# EAGLE schematic PIC16F876A (EAGLE 9.1.3)
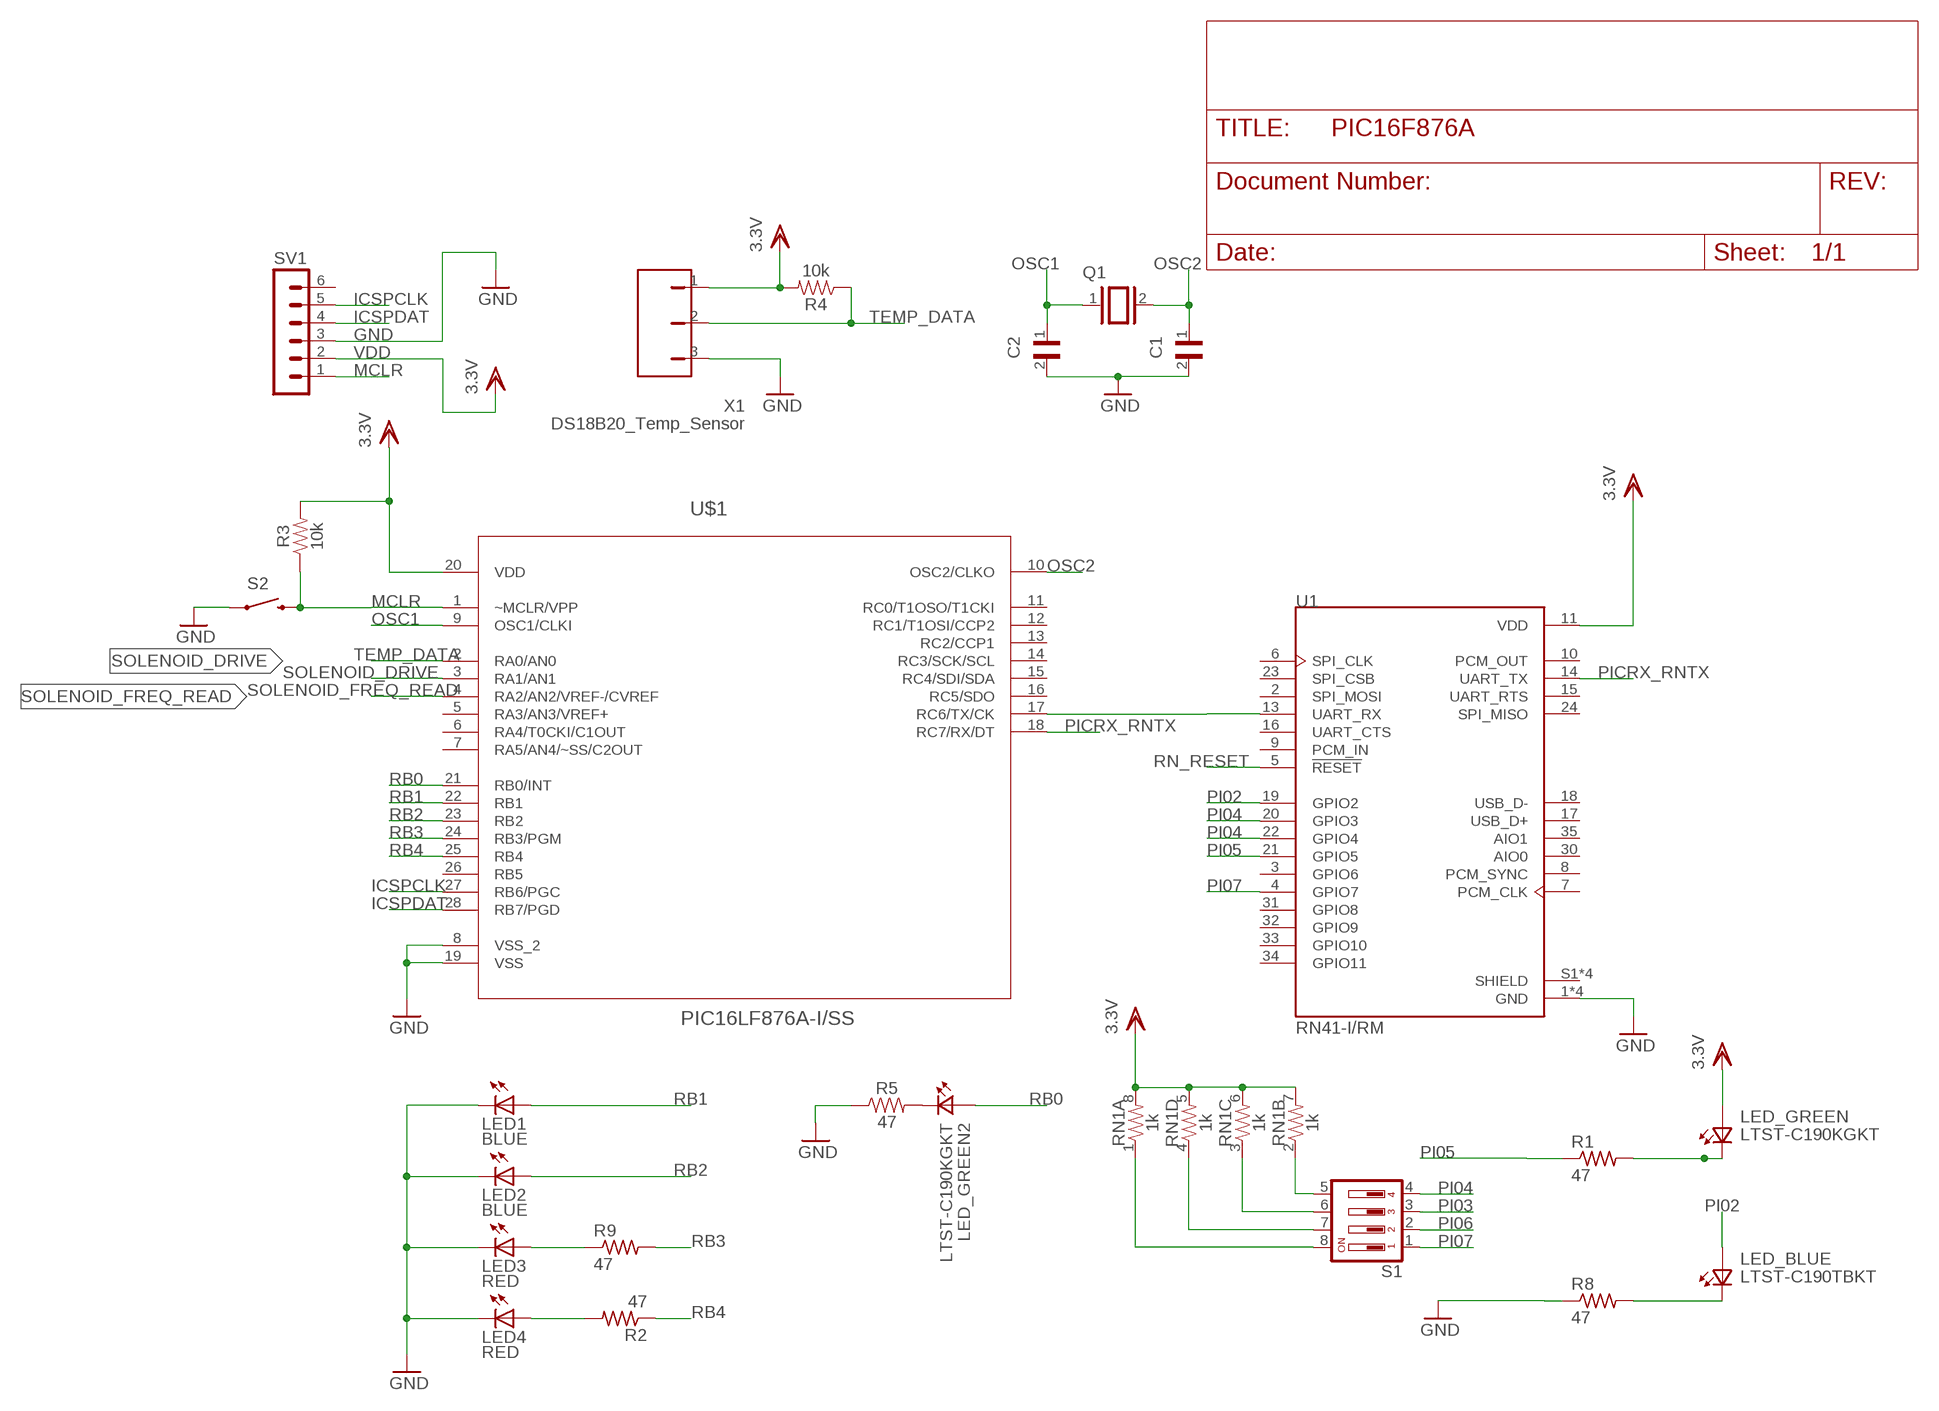
[diagram p0: schematic, sheet 1]

## Parts
C1  08052U220JAT2A  [CAPC2012X140N]
C2  08052U220JAT2A  [CAPC2012X140N]
LED1  BLUE  LED_E  [LED_1206]
LED2  BLUE  LED_E  [LED_1206]
LED3  RED  LED_E  [LED_1206]
LED4  RED  LED_E  [LED_1206]
LED_BLUE  LTST-C190TBKT  [0603]
LED_GREEN  LTST-C190KGKT  [0603]
LED_GREEN2  LTST-C190KGKT  [0603]
Q1  XTAL/S  [QS]
R1  47  R-US_0204/7  [0204/7]
R2  47  R-US_0204/7  [0204/7]
R3  10k  10KOHM-0603-1/10W-1%  [0603]
R4  10k  10KOHM-0603-1/10W-1%  [0603]
R5  47  220OHM-0603-1/10W-1%  [0603]
R8  47  R-US_0204/7  [0204/7]
R9  47  R-US_0204/7  [0204/7]
RN1  1k  1KOHM-ARRAY(4)-0805_ARV-1/10W-5%  [0805-ARV]
S1  DIP04YL  [DIP04YL]
S2  SWITCH-MOMENTARY-SPSTSMD-3  [TACTILE_SWITCH_SMD-3]
SV1  MA06-1  [MA06-1]
U1  RN41-I/RM  [XCVR_RN42-I/RM]
U$1  PIC16LF876A-I/SS  [SOP254P785X200-28N]
X1  DS18B20_Temp_Sensor  S3B-XH-A(LF)(SN)  [S3B-XH-A(LF)(SN)]

## Nets
GND: C1.2 C2.2 LED1.C LED2.C LED3.C LED4.C R5.1 R8.1 S2.1 SV1.3 U1.1(GND) U1.12(GND) U1.28(GND) U1.29(GND) U$1.8(VSS_2) U$1.19(VSS) X1.3
ICSPCLK: SV1.5 U$1.27(RB6/PGC)
ICSPDAT: SV1.4 U$1.28(RB7/PGD)
MCLR: SV1.1 U$1.1(~MCLR/VPP)
N$1: R9.2
N$2: LED_GREEN.1(K2) R1.2
N$3: U1.13(UART_RX) U$1.17(RC6/TX/CK)
N$4: R3.1 S2.4
N$5: U$1.20(VDD)
N$6: LED_GREEN2.1(K2) R5.2
N$7: RN1.2 S1.5
N$8: RN1.3 S1.6
N$9: RN1.4 S1.7
N$10: RN1.1 S1.8
N$15: R2.1
N$17: LED_BLUE.1(K2) R8.2
OSC1: C2.1 Q1.1 U$1.9(OSC1/CLKI)
OSC2: C1.1 Q1.2 U$1.10(OSC2/CLKO)
PI02: LED_BLUE.2(A2) U1.19(GPIO2)
PI03: S1.3
PI04: S1.4 U1.20(GPIO3) U1.22(GPIO4)
PI05: R1.1 U1.21(GPIO5)
PI06: S1.2
PI07: S1.1 U1.4(GPIO7)
PICRX_RNTX: U1.14(UART_TX) U$1.18(RC7/RX/DT)
RB0: LED_GREEN2.2(A2) U$1.21(RB0/INT)
RB1: LED1.A U$1.22(RB1)
RB2: LED2.A U$1.23(RB2)
RB3: LED3.A R9.1 U$1.24(RB3/PGM)
RB4: LED4.A R2.2 U$1.25(RB4)
RN_RESET: U1.5(!RESET)
SOLENOID_DRIVE: U$1.3(RA1/AN1)
SOLENOID_FREQ_READ: U$1.4(RA2/AN2/VREF-/CVREF)
TEMP_DATA: R4.1 U$1.2(RA0/AN0) X1.2
VDD: LED_GREEN.2(A2) R3.2 R4.2 RN1.5 RN1.6 RN1.7 RN1.8 SV1.2 U1.11(VDD) X1.1 ; supply symbol labelled 3.3V
Unconnected: SV1.6 U1.2(SPI_MOSI) U1.3(GPIO6) U1.6(SPI_CLK) U1.7(PCM_CLK) U1.8(PCM_SYNC) U1.9(PCM_IN) U1.10(PCM_OUT) U1.15(UART_RTS) U1.16(UART_CTS) U1.17(USB_D+) U1.18(USB_D-) U1.23(SPI_CSB) U1.24(SPI_MISO) U1.30(AIO0) U1.31(GPIO8) U1.32(GPIO9) U1.33(GPIO10) U1.34(GPIO11) U1.35(AIO1) U$1.5(RA3/AN3/VREF+) U$1.6(RA4/T0CKI/C1OUT) U$1.7(RA5/AN4/~SS/C2OUT) U$1.11(RC0/T1OSO/T1CKI) U$1.12(RC1/T1OSI/CCP2) U$1.13(RC2/CCP1) U$1.14(RC3/SCK/SCL) U$1.15(RC4/SDI/SDA) U$1.16(RC5/SDO) U$1.26(RB5)

## Power pins joined to a net without a drawn wire
SHIELD: U1.S1(SHIELD) U1.S2(SHIELD) U1.S3(SHIELD) U1.S4(SHIELD)

## Library data of the parts
C1 C2 = 08052U220JAT2A:08052U220JAT2A: Cap Ceramic 22pF 200V C0G 5% SMD 0805 125°C T/R; AVAILABILITY: Unavailable; DESCRIPTION: Cap Ceramic 22pF 200V C0G 5% SMD 0805 125°C T/R; MF: AVX; MP: 08052U220JAT2A; PACKAGE: 0805 AVX; PRICE: None
LED1-LED4 = eagle-ltspice:LED_E: LED Source: http://www.osram.convergy.de Source: www.luxeon.com Source: www.kingbright.com; SPICEMODEL: NONE; SPICEPREFIX: D; SPICETYPE: diode
LED_BLUE = LTST-C190TBKT:LTST-C190TBKT: http://octopart.com/ltst-c190tbkt-lite-on-550003; AVAILABILITY: Unavailable; DESCRIPTION: Blue 1.6 x 0.8 x 0.8 mm 130° Water Clear 112 mcd 3.8 V SMT LED; MF: Lite-On Inc.; MP: LTST-C190TBKT; PACKAGE: 0603 Lite-On; PRICE: None
LED_GREEN LED_GREEN2 = LTST-C190KGKT:LTST-C190KGKT: http://octopart.com/ltst-c190krkt-lite-on-549893; AVAILABILITY: Unavailable; DESCRIPTION: Green 1.6 x 0.8 x 0.8 mm 130° Water Clear 35 mcd 2 V LED SMT; MF: Lite-On Inc.; MP: LTST-C190KGKT; PACKAGE: 0603 Lite-On; PRICE: None
Q1 = special:XTAL/S: CRYSTAL
R1 R2 R8 R9 = rcl:R-US_: RESISTOR, American symbol; SPICEPREFIX: R
R3 R4 = SparkFun-Resistors:10KOHM: 10kΩ resistor A resistor is a passive two-terminal electrical component that implements electrical resistance as a circuit element. Resistors act to reduce current flow, and, at the same time, act to lower voltage levels within circuits. - Wikipedia; PROD_ID: RES-00824
R5 = SparkFun-Resistors:220OHM: 220Ω resistor A resistor is a passive two-terminal electrical component that implements electrical resistance as a circuit element. Resistors act to reduce current flow, and, at the same time, act to lower voltage levels within circuits. - Wikipedia; PROD_ID: RES-07861; VALUE: 220
RN1 = SparkFun-Resistors:1KOHM-ARRAY(4): 4 x 1kΩ resistor array A resistor is a passive two-terminal electrical component that implements electrical resistance as a circuit element. Resistors act to reduce current flow, and, at the same time, act to lower voltage levels within circuits. - Wikipedia An array is a collection of discrete resistors in a single package.; PROD_ID: RES-13020
S1 = switch-dil:DIP04YL: DIL/CODE SWITCH; OC_FARNELL: unknown; OC_NEWARK: unknown
S2 = SparkFun-Retired:SWITCH-MOMENTARY-SPST: Various NO switches- pushbuttons, reed, etc
SV1 = con-lstb:MA06-1: PIN HEADER; OC_FARNELL: unknown; OC_NEWARK: unknown
U1 = RN41-I_RM:RN41-I/RM: Bluetooth Class I 35-Pin SMD Tray; AVAILABILITY: Unavailable; DESCRIPTION: RN-41 Series 100 Meter Range 3 Mbps Class 1 Bluetooth Module; MF: Microchip; MP: RN41-I/RM; PACKAGE: SMD-35 Microchip; PRICE: None
U$1 = PIC16LF876A-I_SS:PIC16LF876A-I/SS: Microcontrollers; AVAILABILITY: Unavailable; DESCRIPTION: PIC16 Series 368 B RAM 14 kB Flash 8-Bit Enhanced Microcontroller - SSOP-28; MF: Microchip; MP: PIC16LF876A-I/SS; PACKAGE: SSOP-28 Microchip; PRICE: None
X1 = S3B-XH-A_LF__SN_:S3B-XH-A(LF)(SN): http://octopart.com/s3b-xh-a%28lf%29%28sn%29-jst-3990375; AVAILABILITY: Unavailable; DESCRIPTION: XH Series 3 Position 2.5 mm Pitch Through Hole Side Entry Shrouded Header; MF: JST Sales; MP: S3B-XH-A_LF__SN_; PACKAGE: FakePackage u; PRICE: None